# EAGLE schematic ADSR (EAGLE 9.6.2)
ABTEILUNG: Technische Informatik; BEARBEITER: Hanna Ihninger; DATUM: 12.12.2019; DOKUMENTART: Schaltplan; GEZ: IhnH; ID: 2AHEL; STATUS: Prototyp; VER: 1.0
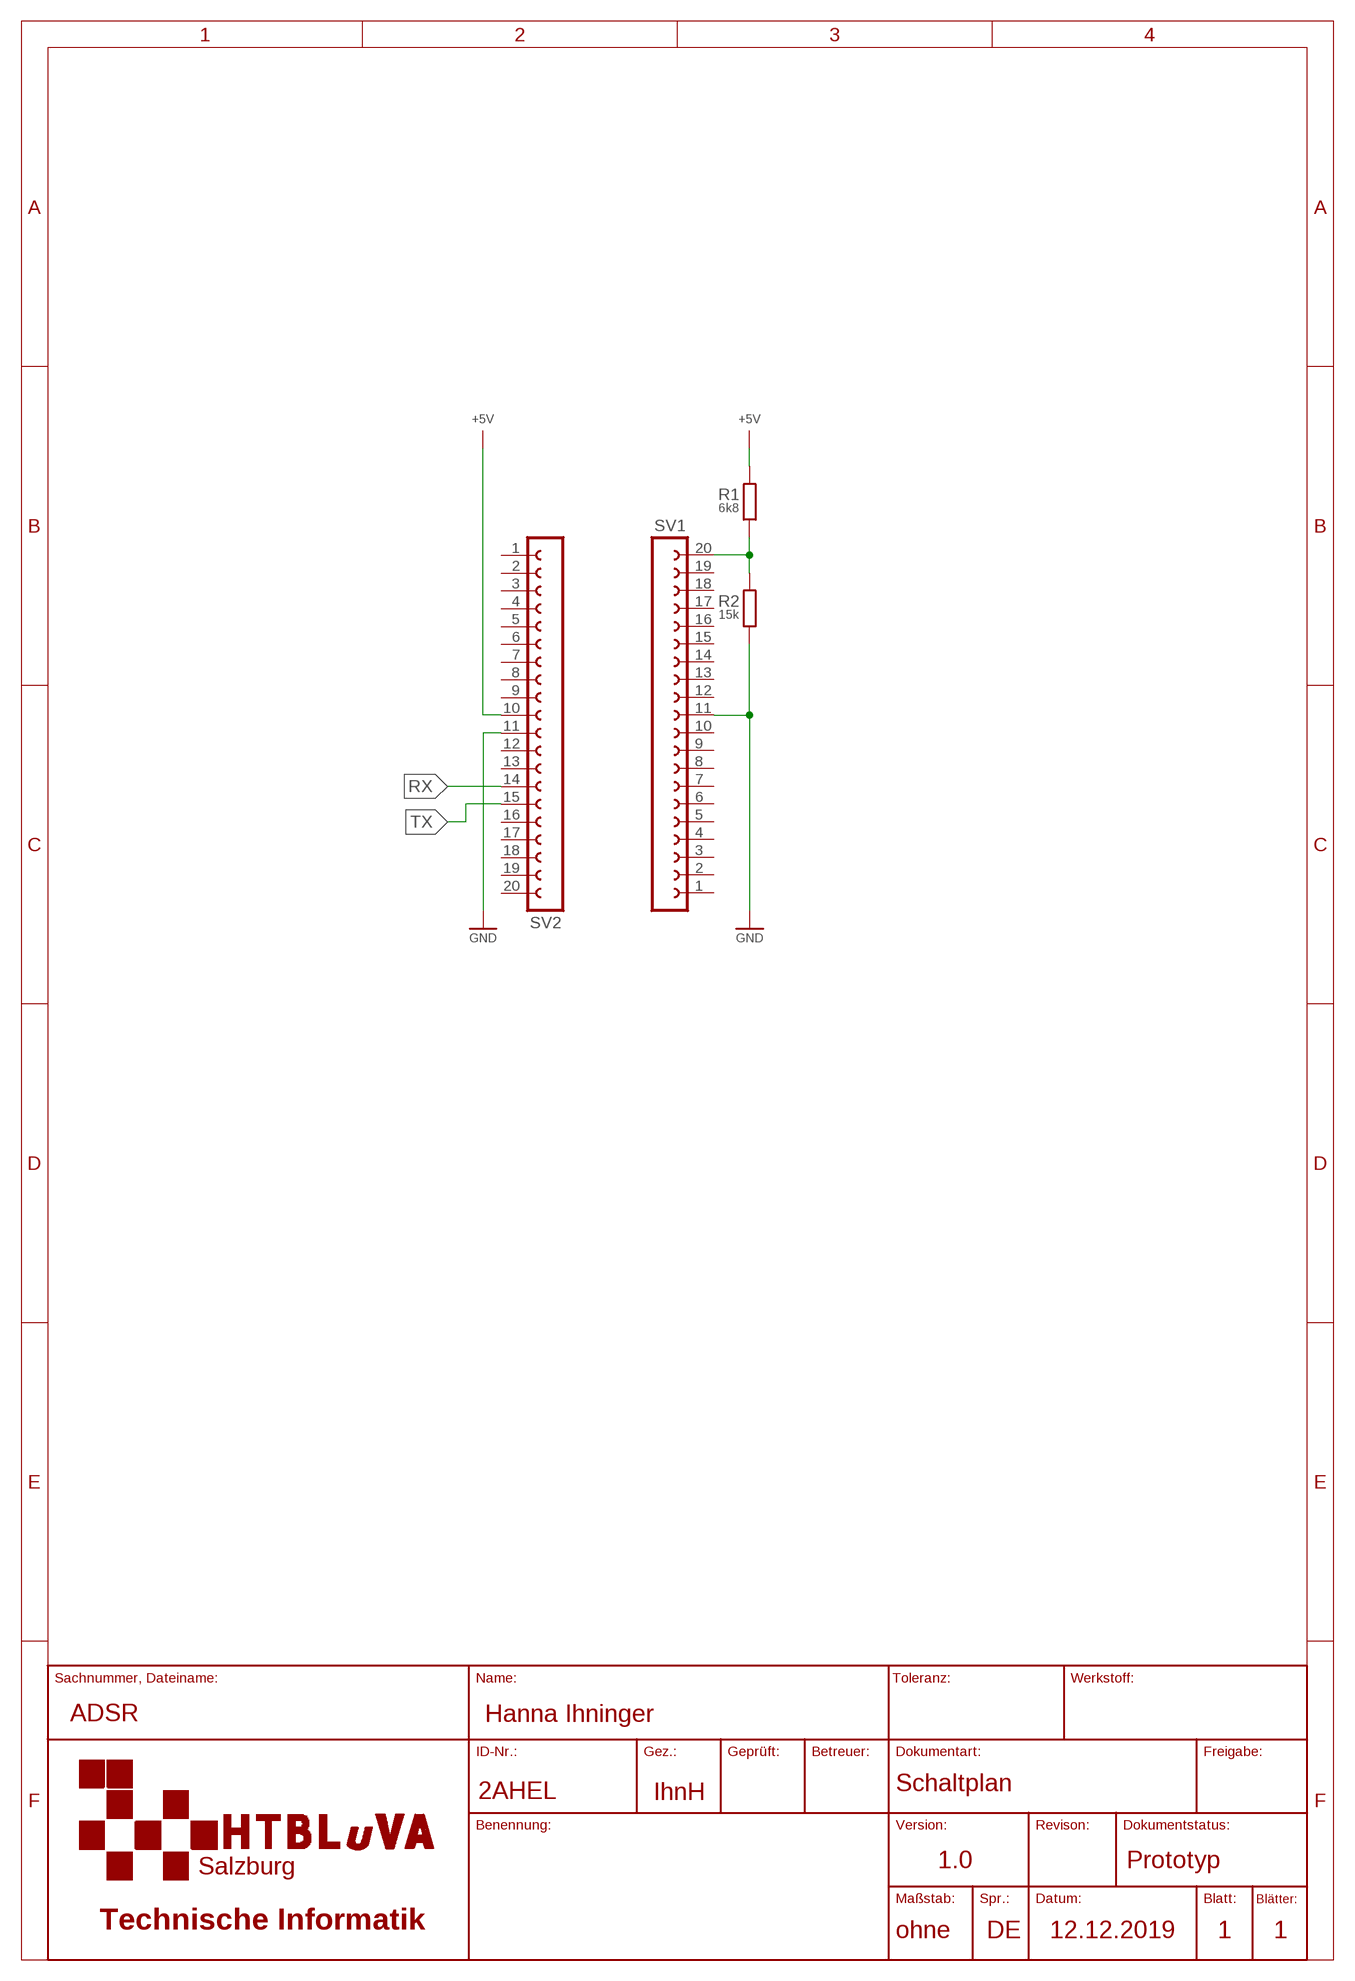
[diagram p0: schematic, sheet 1]

## Parts
R1  6k8  R-EUSR1206  [R1206]
R2  15k  R-EUSR1206  [R1206]
SV1  FE20-1  [FE20]
SV2  FE20-1  [FE20]

## Nets
+5V: R1.2 SV2.10
GND: R2.1 SV1.11 SV2.11
N$5: R1.1 R2.2 SV1.20
RX: SV2.14
TX: SV2.15
Unconnected: SV1.1 SV1.2 SV1.3 SV1.4 SV1.5 SV1.6 SV1.7 SV1.8 SV1.9 SV1.10 SV1.12 SV1.13 SV1.14 SV1.15 SV1.16 SV1.17 SV1.18 SV1.19 SV2.1 SV2.2 SV2.3 SV2.4 SV2.5 SV2.6 SV2.7 SV2.8 SV2.9 SV2.12 SV2.13 SV2.16 SV2.17 SV2.18 SV2.19 SV2.20

## Library data of the parts
R1 R2 = rcl_GruS:R-EUS: RESISTOR, European symbol
SV1 SV2 = con-lsta:FE20-1: FEMALE HEADER; OC_FARNELL: unknown; OC_NEWARK: unknown